# EAGLE design 4 x 4 block (EAGLE 6.4)
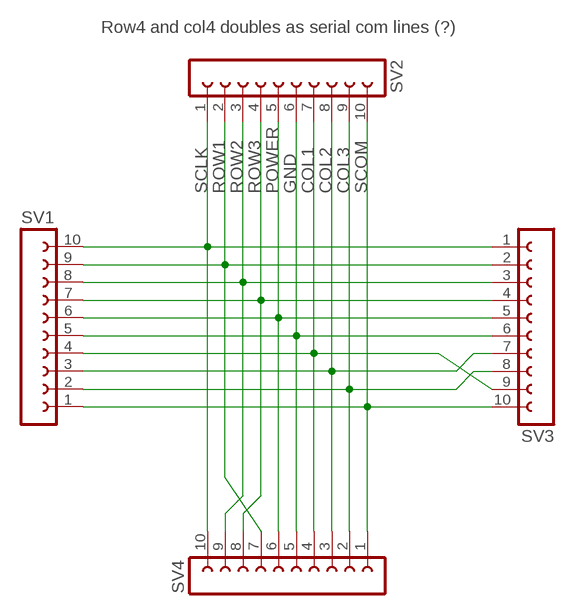
[diagram p0: schematic, sheet 1]

## Parts
SV1  FE10-1  [FE10]
SV2  FE10-1  [FE10]
SV3  FE10-1  [FE10]
SV4  FE10-1  [FE10]

## Nets
COL1: SV1.4 SV2.7 SV3.9 SV4.4
COL2: SV1.3 SV2.8 SV3.7 SV4.3
COL3: SV1.2 SV2.9 SV3.8 SV4.2
GND: SV1.5 SV2.6 SV3.6 SV4.5
POWER: SV1.6 SV2.5 SV3.5 SV4.6
ROW1: SV1.9 SV2.2 SV3.2 SV4.7
ROW2: SV1.8 SV2.3 SV3.3 SV4.9
ROW3: SV1.7 SV2.4 SV3.4 SV4.8
SCLK: SV1.10 SV2.1 SV3.1 SV4.10
SCOM: SV1.1 SV2.10 SV3.10 SV4.1

## Notes on the sheet
- Row4 and col4 doubles as serial com lines (?)

## Library data of the parts
SV1-SV4 = joakim:FE10-1: FEMALE HEADER; OC_FARNELL: unknown; OC_NEWARK: unknown

## Board
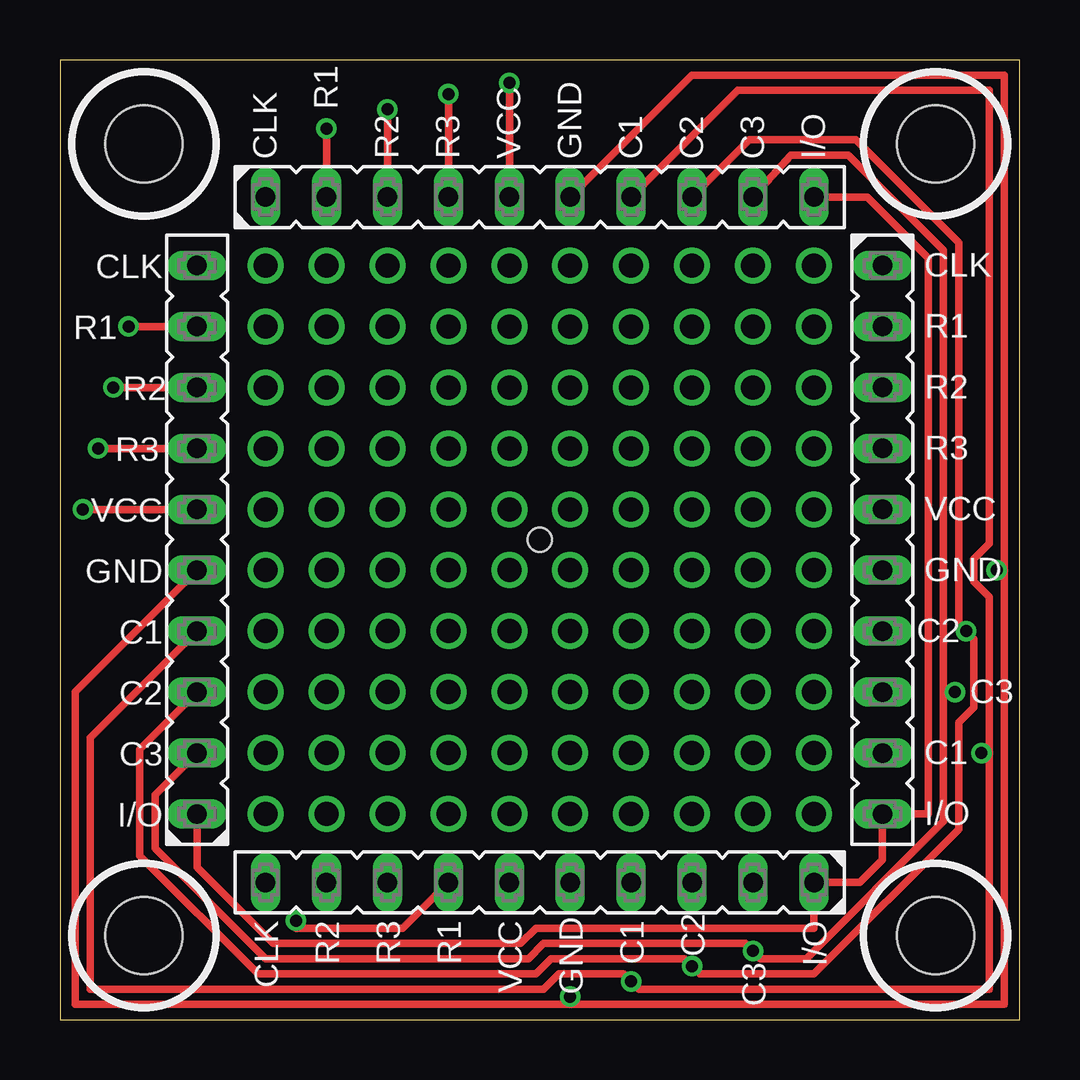
[diagram p1: board, top side]
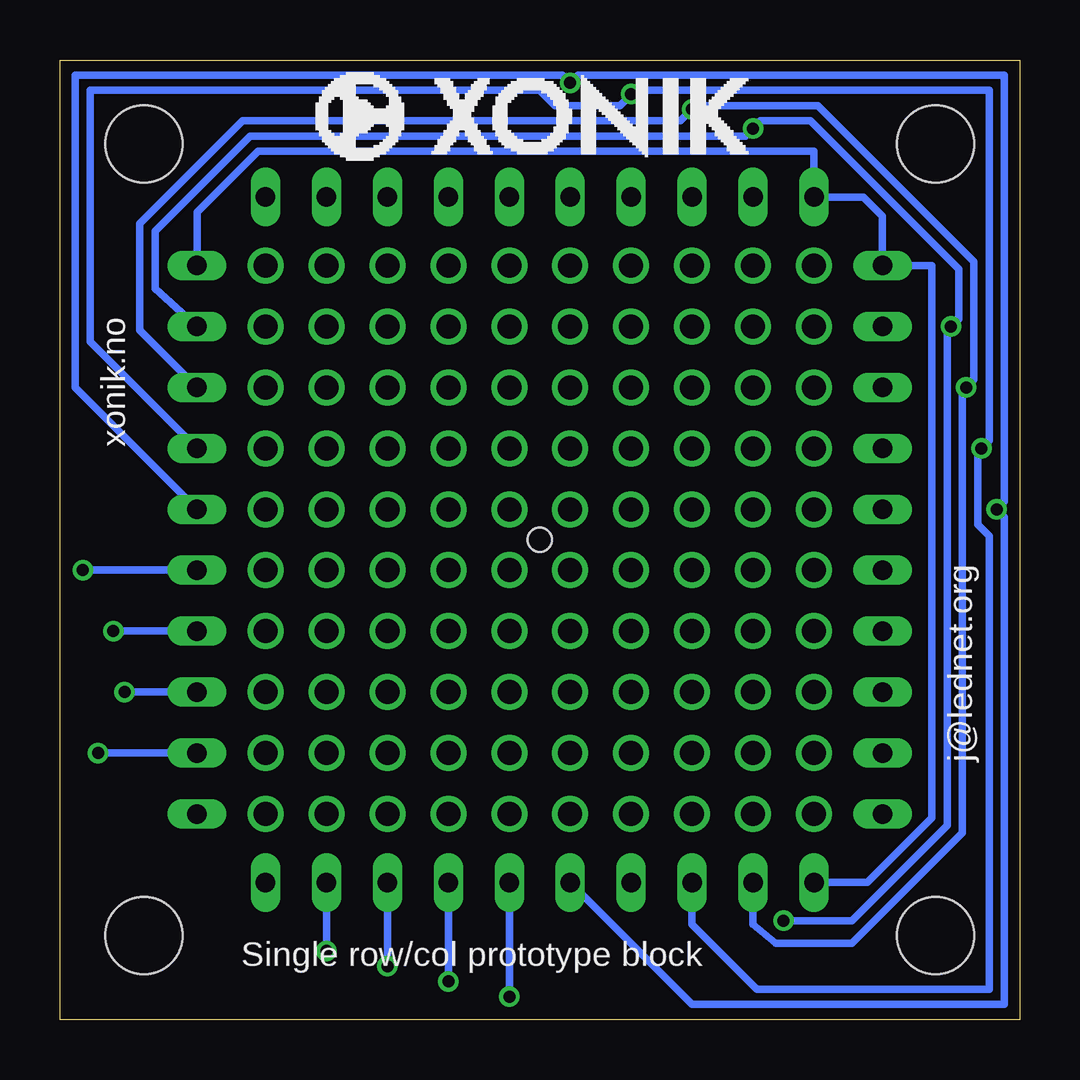
[diagram p2: board, bottom side, seen from below]

Size 40 x 40 mm. Coordinates in mm from the lower left corner, seen from the top.
Outline: 0,0 40,0 40,40 0,40 0,0
Copper layers (1*16): Top 0.0356mm / dielectric 1.5011mm / Bottom 0.0356mm
Design rules "LaenPCBOrder": minimum track width 6mil, minimum drill 13mil, track to track 6mil, track to pad 6mil, pad to pad 6mil, via to via 6mil, smd to smd 6mil, copper to edge 15mil, drill to drill 6mil, minimum pad ring 7mil, minimum via ring 7mil, stop-mask expansion 3mil, vias tented up to drill 0mil, thermal gap 10mil
Holes 3.2 mm at 3.5,36.5 36.5,36.5 36.5,3.5 3.5,3.5
Holes 1 mm at 20,20

### Footprints (pad centres in the part's own frame; a part is rotated, then mirrored left to right if it is on the bottom)
FE10 = drill 0.813 long: 1 -11.43,0; 2 -8.89,0; 3 -6.35,0; 4 -3.81,0; 5 -1.27,0; 6 1.27,0; 7 3.81,0; 8 6.35,0; 9 8.89,0; 10 11.43,0

### Placement (x,y rotation side)
SV1  5.71,20 90 top
SV2  20,34.29 0 top
SV3  34.29,20 270 top
SV4  20,5.71 180 top

### Tracks (layer width: path | path; a pad name or v marks a point on that pad's centre or on a via)
COL1  (via drill 0.5)
  Top 0.305: SV1.4 1.27,11.74 1.27,1.27 20.16,1.27 20.79,1.9 23.49,1.9 v23.81,1.58 24.13,1.27 38.73,1.27 38.73,11.11 | SV2.7 28.25,38.73 38.73,38.73 38.73,19.84 38.1,19.21 38.1,18.25 38.73,17.62 38.73,11.11 | v38.42,11.11 38.73,11.11
  Bottom 0.305: v23.81,1.58 SV4.4 | SV3.9 v38.42,11.11
COL2  (via drill 0.5)
  Top 0.305: SV1.3 3.33,11.27 3.33,6.82 8.25,1.9 19.84,1.9 20.48,2.54 26.03,2.54 v26.35,2.22 26.67,1.9 31.43,1.9 37.46,7.94 37.46,12.38 38.1,13.01 38.1,15.87 v37.78,16.19 37.46,16.51 37.46,32.38 33.18,36.67 28.73,36.67 SV2.8
  Bottom 0.305: v26.35,2.22 SV4.3 | v37.78,16.19 SV3.7
COL3  (via drill 0.5)
  Top 0.305: SV1.2 3.97,9.36 3.97,7.14 8.57,2.54 19.52,2.54 20.16,3.17 28.57,3.17 v28.89,2.85 29.21,2.54 31.11,2.54 36.83,8.25 36.83,13.65 | 36.83,13.65 36.83,32.06 32.86,36.03 30.48,36.03 SV2.9 | v37.3,13.65 36.83,13.65
  Bottom 0.305: v28.89,2.85 SV4.2 | SV3.8 v37.3,13.65
GND  (via drill 0.5)
  Top 0.305: SV1.5 0.63,13.65 0.63,0.63 21.27,0.63 | 21.27,0.63 39.37,0.63 39.37,18.73 | 39.37,18.73 39.37,39.37 26.35,39.37 SV2.6 | 21.27,0.63 v21.27,0.95 | v39.05,18.73 39.37,18.73
  Bottom 0.305: v21.27,0.95 SV4.5 | SV3.6 v39.05,18.73
N$1  (via drill 1)
  other vias: 8.57,31.43
N$2  (via drill 1)
  other vias: 11.11,31.43
N$3  (via drill 1)
  other vias: 13.65,31.43
N$4  (via drill 1)
  other vias: 16.19,31.43
N$5  (via drill 1)
  other vias: 18.73,31.43
N$6  (via drill 1)
  other vias: 21.27,31.43
N$7  (via drill 1)
  other vias: 23.81,31.43
N$8  (via drill 1)
  other vias: 26.35,31.43
N$9  (via drill 1)
  other vias: 28.89,31.43
N$10  (via drill 1)
  other vias: 31.43,31.43
N$11  (via drill 1)
  other vias: 8.57,28.89
N$12  (via drill 1)
  other vias: 11.11,28.89
N$13  (via drill 1)
  other vias: 13.65,28.89
N$14  (via drill 1)
  other vias: 16.19,28.89
N$15  (via drill 1)
  other vias: 18.73,28.89
N$16  (via drill 1)
  other vias: 21.27,28.89
N$17  (via drill 1)
  other vias: 23.81,28.89
N$18  (via drill 1)
  other vias: 26.35,28.89
N$19  (via drill 1)
  other vias: 28.89,28.89
N$20  (via drill 1)
  other vias: 31.43,28.89
N$21  (via drill 1)
  other vias: 8.57,26.35
N$22  (via drill 1)
  other vias: 11.11,26.35
N$23  (via drill 1)
  other vias: 13.65,26.35
N$24  (via drill 1)
  other vias: 16.19,26.35
N$25  (via drill 1)
  other vias: 18.73,26.35
N$26  (via drill 1)
  other vias: 21.27,26.35
N$27  (via drill 1)
  other vias: 23.81,26.35
N$28  (via drill 1)
  other vias: 26.35,26.35
N$29  (via drill 1)
  other vias: 28.89,26.35
N$30  (via drill 1)
  other vias: 31.43,26.35
N$31  (via drill 1)
  other vias: 8.57,23.81
N$32  (via drill 1)
  other vias: 11.11,23.81
N$33  (via drill 1)
  other vias: 13.65,23.81
N$34  (via drill 1)
  other vias: 16.19,23.81
N$35  (via drill 1)
  other vias: 18.73,23.81
N$36  (via drill 1)
  other vias: 21.27,23.81
N$37  (via drill 1)
  other vias: 23.81,23.81
N$38  (via drill 1)
  other vias: 26.35,23.81
N$39  (via drill 1)
  other vias: 28.89,23.81
N$40  (via drill 1)
  other vias: 31.43,23.81
N$41  (via drill 1)
  other vias: 8.57,21.27
N$42  (via drill 1)
  other vias: 11.11,21.27
N$43  (via drill 1)
  other vias: 13.65,21.27
N$44  (via drill 1)
  other vias: 16.19,21.27
N$45  (via drill 1)
  other vias: 18.73,21.27
N$46  (via drill 1)
  other vias: 21.27,21.27
N$47  (via drill 1)
  other vias: 23.81,21.27
N$48  (via drill 1)
  other vias: 26.35,21.27
N$49  (via drill 1)
  other vias: 28.89,21.27
N$50  (via drill 1)
  other vias: 31.43,21.27
N$51  (via drill 1)
  other vias: 8.57,18.73
N$52  (via drill 1)
  other vias: 11.11,18.73
N$53  (via drill 1)
  other vias: 13.65,18.73
N$54  (via drill 1)
  other vias: 16.19,18.73
N$55  (via drill 1)
  other vias: 18.73,18.73
N$56  (via drill 1)
  other vias: 21.27,18.73
N$57  (via drill 1)
  other vias: 23.81,18.73
N$58  (via drill 1)
  other vias: 26.35,18.73
N$59  (via drill 1)
  other vias: 28.89,18.73
N$60  (via drill 1)
  other vias: 31.43,18.73
N$61  (via drill 1)
  other vias: 8.57,16.19
N$62  (via drill 1)
  other vias: 11.11,16.19
N$63  (via drill 1)
  other vias: 13.65,16.19
N$64  (via drill 1)
  other vias: 16.19,16.19
N$65  (via drill 1)
  other vias: 18.73,16.19
N$66  (via drill 1)
  other vias: 21.27,16.19
N$67  (via drill 1)
  other vias: 23.81,16.19
N$68  (via drill 1)
  other vias: 26.35,16.19
N$69  (via drill 1)
  other vias: 28.89,16.19
N$70  (via drill 1)
  other vias: 31.43,16.19
N$71  (via drill 1)
  other vias: 8.57,13.65
N$72  (via drill 1)
  other vias: 11.11,13.65
N$73  (via drill 1)
  other vias: 13.65,13.65
N$74  (via drill 1)
  other vias: 16.19,13.65
N$75  (via drill 1)
  other vias: 18.73,13.65
N$76  (via drill 1)
  other vias: 21.27,13.65
N$77  (via drill 1)
  other vias: 23.81,13.65
N$78  (via drill 1)
  other vias: 26.35,13.65
N$79  (via drill 1)
  other vias: 28.89,13.65
N$80  (via drill 1)
  other vias: 31.43,13.65
N$81  (via drill 1)
  other vias: 8.57,11.11
N$82  (via drill 1)
  other vias: 11.11,11.11
N$83  (via drill 1)
  other vias: 13.65,11.11
N$84  (via drill 1)
  other vias: 16.19,11.11
N$85  (via drill 1)
  other vias: 18.73,11.11
N$86  (via drill 1)
  other vias: 21.27,11.11
N$87  (via drill 1)
  other vias: 23.81,11.11
N$88  (via drill 1)
  other vias: 26.35,11.11
N$89  (via drill 1)
  other vias: 28.89,11.11
N$90  (via drill 1)
  other vias: 31.43,11.11
N$91  (via drill 1)
  other vias: 8.57,8.57
N$92  (via drill 1)
  other vias: 11.11,8.57
N$93  (via drill 1)
  other vias: 13.65,8.57
N$94  (via drill 1)
  other vias: 16.19,8.57
N$95  (via drill 1)
  other vias: 18.73,8.57
N$96  (via drill 1)
  other vias: 21.27,8.57
N$97  (via drill 1)
  other vias: 23.81,8.57
N$98  (via drill 1)
  other vias: 26.35,8.57
N$99  (via drill 1)
  other vias: 28.89,8.57
N$100  (via drill 1)
  other vias: 31.43,8.57
POWER  (via drill 0.5)
  Top 0.305: v18.73,39.05 SV2.5 | v0.95,21.27 SV1.6
  Bottom 0.305: SV3.5 39.37,26.35 39.37,39.37 19.05,39.37 v18.73,39.05 18.41,39.37 0.63,39.37 0.63,21.59 v0.95,21.27 0.63,20.95 0.63,0.63 13.65,0.63 SV4.6
ROW1  (via drill 0.5)
  Top 0.305: SV2.2 v11.11,37.15 | v2.85,28.89 SV1.9 | v9.84,4.12 9.84,3.81 14.29,3.81 SV4.7
  Bottom 0.305: SV3.2 36.03,30.48 36.03,32.86 32.06,36.83 11.43,36.83 v11.11,37.15 10.79,37.46 8.73,37.46 2.54,31.27 2.54,29.21 v2.85,28.89 3.01,28.73 3.01,8.09 6.98,4.12 v9.84,4.12
ROW2  (via drill 0.5)
  Top 0.305: v13.65,37.94 SV2.3 | v2.22,26.35 SV1.8
  Bottom 0.305: SV3.3 36.67,28.73 36.67,33.18 32.38,37.46 14.13,37.46 v13.65,37.94 13.49,38.1 8.41,38.1 1.9,31.59 1.9,26.67 v2.22,26.35 2.38,26.19 2.38,7.78 6.98,3.17 10.16,3.17 11.11,3.97 SV4.9
ROW3  (via drill 0.5)
  Top 0.305: v16.19,38.57 SV2.4 | v1.58,23.81 SV1.7
  Bottom 0.305: SV3.4 38.73,28.25 38.73,38.73 20,38.73 19.36,38.1 16.67,38.1 v16.19,38.57 16.03,38.73 1.27,38.73 1.27,24.13 v1.58,23.81 1.74,23.65 1.74,20.63 1.27,20.16 1.27,1.27 10.95,1.27 13.65,3.97 SV4.8
SCLK
  Bottom 0.305: SV4.10 6.35,5.71 3.65,8.41 3.65,31.43 SV1.10 5.71,33.49 6.51,34.29 SV2.1 8.57,36.19 31.75,36.19 34.29,33.65 SV3.1
SCOM
  Top 0.305: SV2.10 33.65,34.29 36.19,31.75 36.19,8.57 SV3.10 34.29,6.67 33.34,5.71 SV4.1 31.43,3.81 19.84,3.81 19.21,3.17 8.89,3.17 5.71,6.35 SV1.1

### Text on the board
tNames: R1 | CLK | R2 | R3 | VCC | GND | C1 | C2 | C3 | I/O | CLK | CLK | R1 | R1 | R2 | R2 | R3 | R3 | VCC | VCC | GND | GND | C1 | C2 | C2 | C3 | C3 | C1 | I/O | I/O | CLK | R2 | R3 | R1 | VCC | GND | C1 | C2 | I/O | C3
bNames: xonik.no | j@lednet.org | Single row/col prototype block